# Altium schematic sheet connectors.SchDoc
size A3; Organization: Develer s.r.l.; Address1: via Mugellese 1/A; Address2: 50019 Campi Bisenzio; Address3: Firenze; Address4: ITALY; Revision: A; SheetNumber: 1; SheetTotal: 1
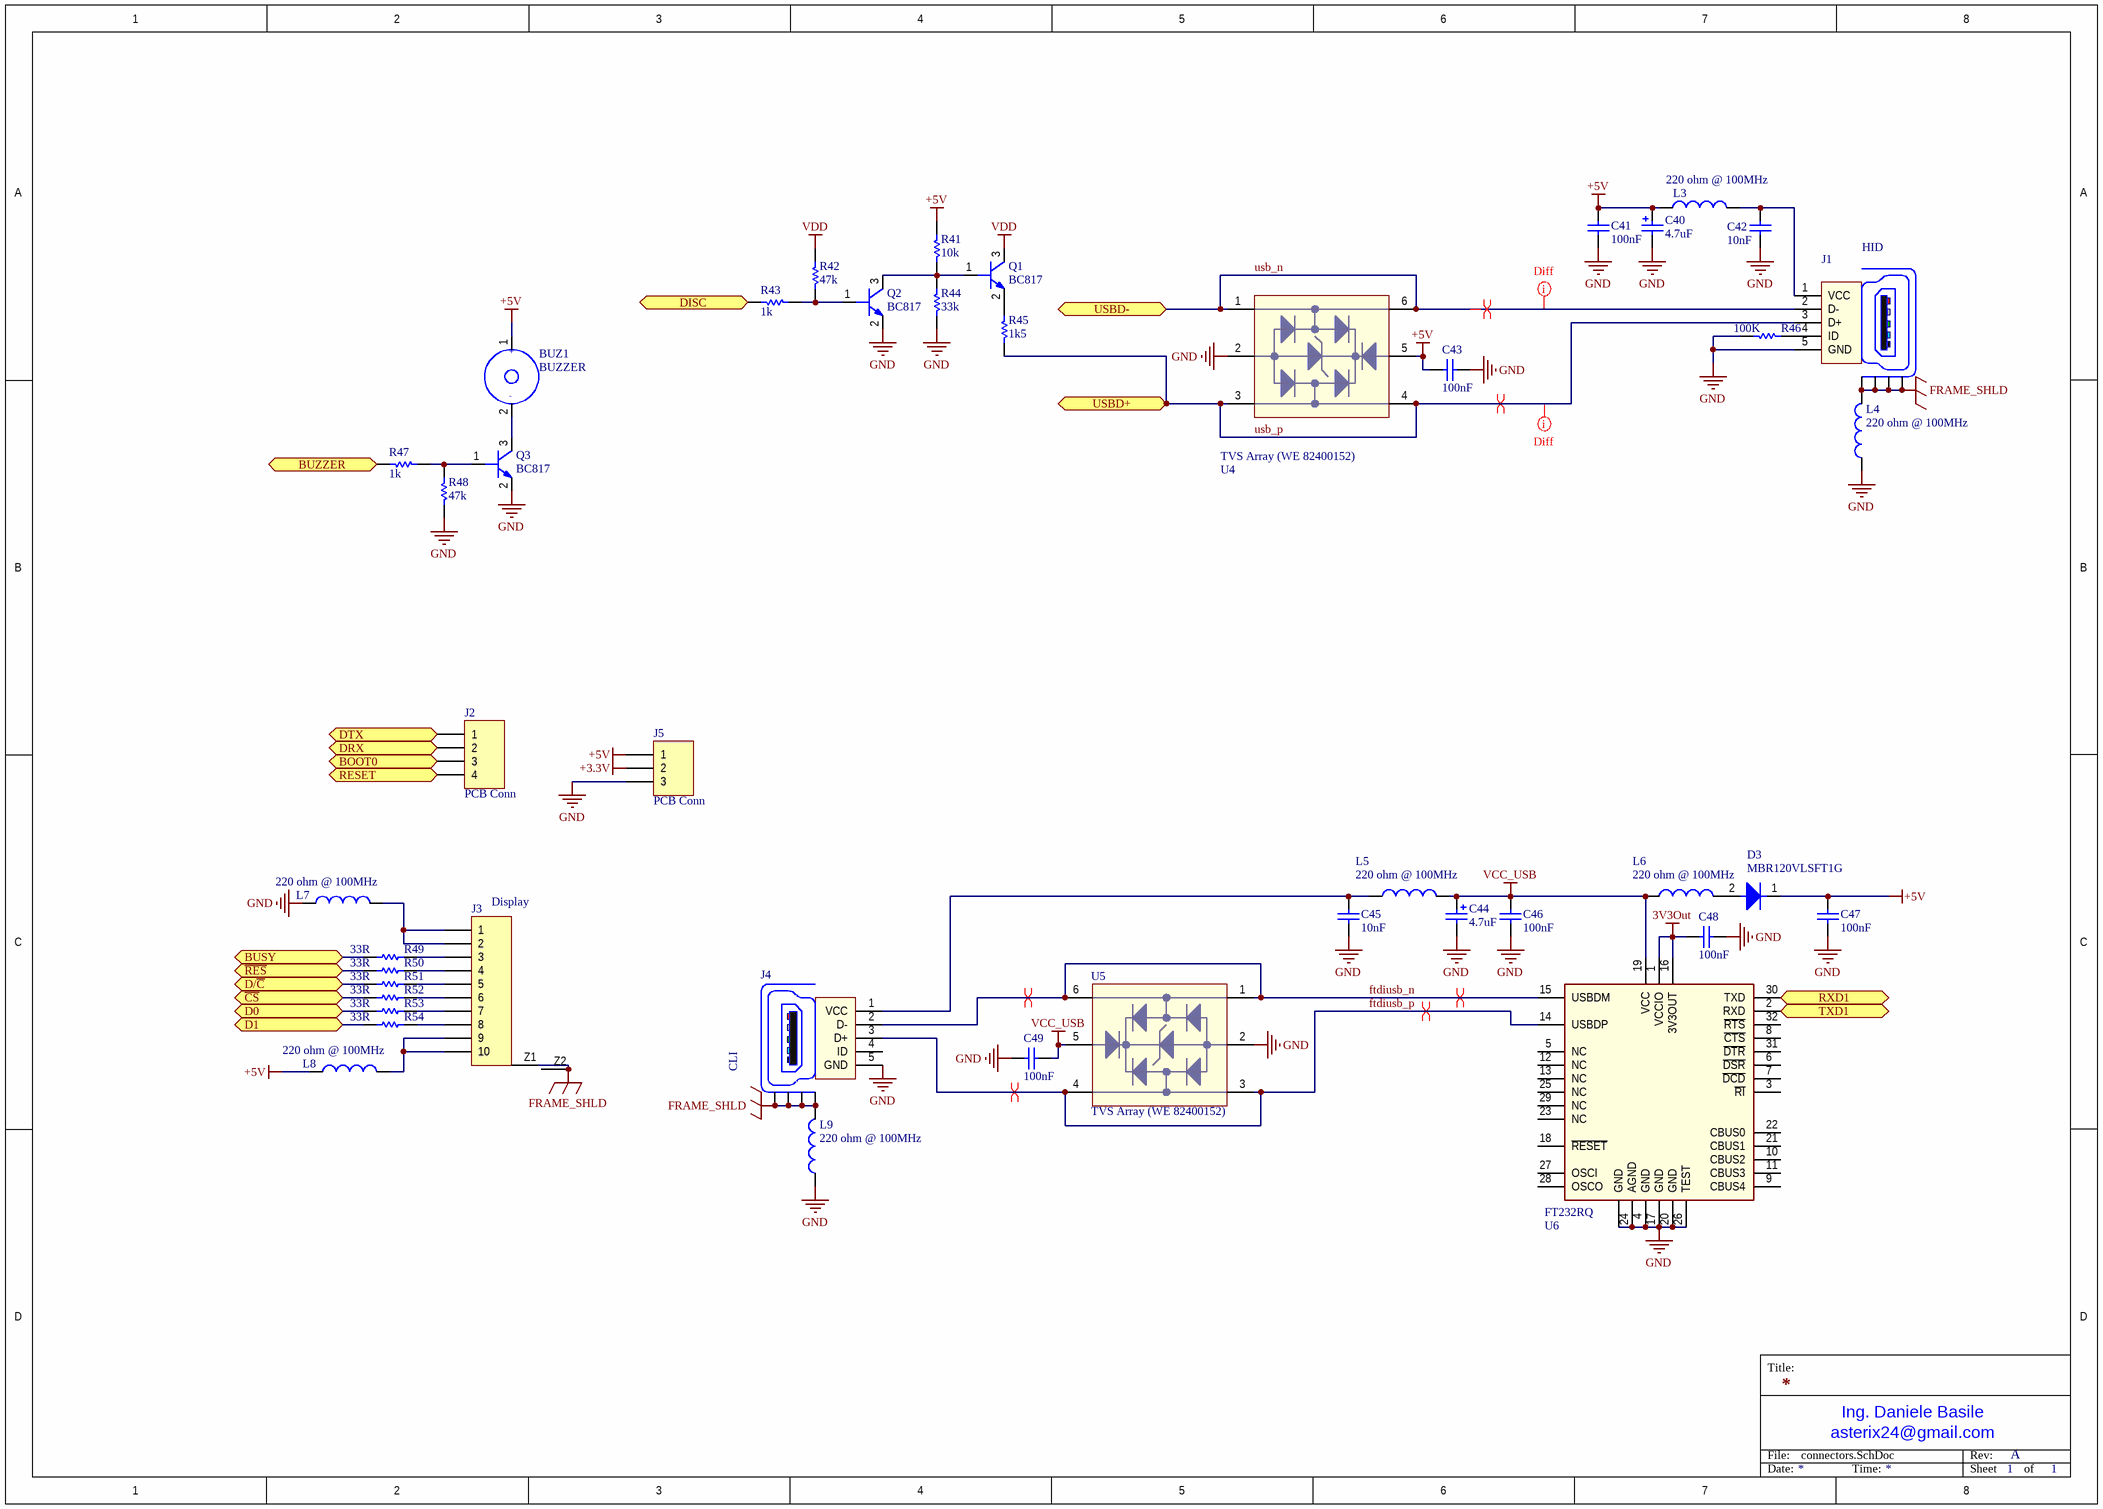
[diagram p0: connectors.SchDoc]

## Parts
BUZ1  BUZZER  [buzzer_14mm_thd]
C40  4.7uF  [1206_[3216]]
C41  100nF  [0603_[1608]]
C42  10nF  [0603_[1608]]
C43  100nF  [0603_[1608]]
C44  4.7uF  [1206_[3216]]
C45  10nF  [0603_[1608]]
C46  100nF  [0603_[1608]]
C47  100nF  [0603_[1608]]
C48  100nF  [0603_[1608]]
C49  100nF  [0603_[1608]]
D3  MBR120VLSFT1G  [SOD-123]
J1  HID  [usb_typeB_mini_smd]
J2  PCB Conn  [HEADER_1X4_2.54MM_THD]
J3  Display  [fcc-zif_10pin_0.5mm]
J4  CLI  [usb_typeB_mini_smd]
J5  PCB Conn  [HEADER_1X3_2.54MM_THD]
L3  220 ohm @ 100MHz  [0805_[2012]]
L4  220 ohm @ 100MHz  [0805_[2012]]
L5  220 ohm @ 100MHz  [0805_[2012]]
L6  220 ohm @ 100MHz  [0805_[2012]]
L7  220 ohm @ 100MHz  [0805_[2012]]
L8  220 ohm @ 100MHz  [0805_[2012]]
L9  220 ohm @ 100MHz  [0805_[2012]]
Q1  BC817  [SOT-23]
Q2  BC817  [SOT-23]
Q3  BC817  [SOT-23]
R41  10k  [0603_[1608]]
R42  47k  [0603_[1608]]
R43  1k  [0603_[1608]]
R44  33k  [0603_[1608]]
R45  1k5  [0603_[1608]]
R46  100K  [0603_[1608]]
R47  1k  [0603_[1608]]
R48  47k  [0603_[1608]]
R49  33R  [0603_[1608]]
R50  33R  [0603_[1608]]
R51  33R  [0603_[1608]]
R52  33R  [0603_[1608]]
R53  33R  [0603_[1608]]
R54  33R  [0603_[1608]]
U4  TVS Array (WE 82400152)  [SOT-563]
U5  TVS Array (WE 82400152)  [SOT-563]
U6  FT232RQ  [QFN-32]

## Ports
BOOT0, BUSY, BUZZER, D0, D1, D/~{C}, DISC, DRX, DTX, RESET, RXD1, TXD1, USBD+, USBD-, ~{CS}, ~{RES}

## Nets
3V3Out: C48.1 U6.1(VCCIO) U6.16(3V3OUT)
+3.3V: J5.2
+5V: BUZ1.1 C40.1 C41.1 C43.2 C47.2 D3.1(K) J5.1 L3.1 L8.1 R41.1 U4.5
FRAME_SHLD: J1.Z1(Shield) J1.Z2(Shield) J1.Z3(Shield) J1.Z4(Shield) J3.Z1 J3.Z2 J4.Z1(Shield) J4.Z2(Shield) J4.Z3(Shield) J4.Z4(Shield) L4.2 L9.2
GND: C40.2 C41.2 C42.2 C43.1 C44.2 C45.2 C46.2 C47.1 C48.2 C49.1 J1.5(GND) J4.5(GND) J5.3 L4.1 L7.1 L9.1 Q2.2(E) Q3.2(E) R44.2 R46.2 R48.2 U4.2 U5.2 U6.4(GND) U6.17(GND) U6.20(GND) U6.24(AGND) U6.26(TEST) U6.GND_PAD(GND)
VCC_USB: C44.1 C46.1 C49.2 L5.1 L6.2 U5.5 U6.19(VCC)
VDD: Q1.3(C) R42.1
BOOT0: J2.3 ; port BOOT0
BUSY: R49.2 ; port BUSY
BUZZER: R47.2 ; port BUZZER
~{CS}: R52.2 ; port ~{CS}
D0: R53.2 ; port D0
D1: R54.2 ; port D1
D/~{C}: R51.2 ; port D/~{C}
DISC: R43.2 ; port DISC
DRX: J2.2 ; port DRX
DTX: J2.1 ; port DTX
ftdiusb_n: J4.2(D-) U5.1 U5.6 U6.15(USBDM)
ftdiusb_p: J4.3(D+) U5.3 U5.4 U6.14(USBDP)
~{RES}: R50.2 ; port ~{RES}
RESET: J2.4 ; port RESET
RXD1: U6.30(TXD) ; port RXD1
TXD1: U6.2(RXD) ; port TXD1
usb_n: J1.2(D-) U4.1 U4.6 ; port USBD-
usb_p: J1.3(D+) R45.2 U4.3 U4.4 ; port USBD+
NetBUZ1_2: BUZ1.2 Q3.3(C)
NetC42_1: C42.1 J1.1(VCC) L3.2
NetC45_1: C45.1 J4.1(VCC) L5.2
NetD3_2: D3.2(A) L6.1
NetJ1_4: J1.4(ID) R46.1
NetJ3_1: J3.1 J3.2 L7.2
NetJ3_3: J3.3 R49.1
NetJ3_4: J3.4 R50.1
NetJ3_5: J3.5 R51.1
NetJ3_6: J3.6 R52.1
NetJ3_7: J3.7 R53.1
NetJ3_8: J3.8 R54.1
NetJ3_9: J3.9 J3.10 L8.2
NetQ1_1: Q1.1(B) Q2.3(C) R41.2 R44.1
NetQ1_2: Q1.2(E) R45.1
NetQ2_1: Q2.1(B) R42.2 R43.1
NetQ3_1: Q3.1(B) R47.1 R48.1

Not connected (* = marked no-connect by the designer): J4 4(ID); U6 3(~{RI}) 5(NC) 6(~{DSR}) 7(~{DCD}) 8(~{CTS}) 9(CBUS4) 10(CBUS2) 11(CBUS3) 12(NC) 13(NC) 18(~{RESET}) 21(CBUS1) 22(CBUS0) 23(NC) 25(NC) 27(OSCI) 28(OSCO) 29(NC) 31(~{DTR}) 32(~{RTS})

## Layout directives
net class usb_diff: usb_n, usb_p
differential pair: ftdiusb_n, ftdiusb_p, usb_n, usb_p

## Notes on the sheet
- Title:
- File:
- asterix24@gmail.com
- Ing. Daniele Basile
- Rev:
- Date:
- Time:
- Sheet
- of
- (in symbol BUZZER) +; -

## Library data of the parts
C40 = Cap Pol1: Ceramic X7R 16V; Value: 10uF; Published: 8-Jun-2000; Revision: July-2002: Re-released for DXP Platform.; Publisher: Altium Limited
C41 C46-C48 = Cap: Ceramic X7R 50V; Value: 10nF; Published: 8-Jun-2000; Revision: July-2002: Re-released for DXP Platform.; Publisher: Altium Limited
C42 C45 = Cap: Ceramic X7R 50V; Published: 8-Jun-2000; Revision: July-2002: Re-released for DXP Platform.; Publisher: Altium Limited; Value: 10nF
C43 C49 = Cap: Ceramic X7R 50V; Value: 100pF; Published: 8-Jun-2000; LatestRevisionDate: 17-Jul-2002; LatestRevisionNote: Re-released for DXP Platform.; PackageReference: RAD-0.3; Publisher: Altium Limited; PackageDescription: Radial Cap, Thru-Hole; 2 Leads; 0.3 in Pin Spacing
C44 = Cap Pol1: Ceramic X5R 25V; Value: 10uF; Published: 8-Jun-2000; Revision: July-2002: Re-released for DXP Platform.; Publisher: Altium Limited
D3 = Diode: Diode Schottky  low Vf, If 1A (PMEG3010ER; MBRX120LF)
J1 = USB_Con_Type_B_mini_SMT: Mini USB SMT Type B 5 Contacts; Manufacturer: Würth Elektronik eiSos GmbH; partNo: 65100516121; ComponentLink1 Description: Manufacturer; ComponentLink2 Description: Datasheet; NoPins: 5; ComponentLink1URL: http://www.we-online.de; ComponentLink2URL: http://katalog.we-online.de/em/datasheet/65100516121.pdf; Created by: Karrer Zheng; Created Date: 10/10/2014
J2 = Header 4: Header, 4-Pin; LatestRevisionDate: 17-Jul-2002; LatestRevisionNote: Re-released for DXP Platform.; Publisher: Altium Limited
J3 = Header 10: Header, 10-Pin; LatestRevisionDate: 17-Jul-2002; LatestRevisionNote: Re-released for DXP Platform.; Publisher: Altium Limited
J4 = USB_Con_Type_B_mini_SMT: Mini USB SMT Type B 5 Contacts (WE 65100516121); Manufacturer: Würth Elektronik eiSos GmbH; ComponentLink1 Description: Manufacturer; ComponentLink2 Description: Datasheet; NoPins: 5; ComponentLink1URL: http://www.we-online.de; ComponentLink2URL: http://katalog.we-online.de/em/datasheet/65100516121.pdf; Created by: Karrer Zheng; Created Date: 10/10/2014; partNo: 65100516121
J5 = Header 3: Header, 3-Pin; LatestRevisionDate: 17-Jul-2002; LatestRevisionNote: Re-released for DXP Platform.; Publisher: Altium Limited
L3-L9 = Inductor: WE 742792022
Q1-Q3 = BC817: BJT NPN
R41 R42 R44 R45 R48-R54 = Res1: Resistor; Value: 1K; Published: 8-Jun-2000; Revision: July-2002: Re-released for DXP Platform.; Publisher: Altium Limited
R43 R47 = Res1: Resistor; Published: 8-Jun-2000; Revision: July-2002: Re-released for DXP Platform.; Publisher: Altium Limited; Value: 1K
R46 = Resistor_ST: Resistor; Value: 10K
U4 U5 = TVS_Diode_Array
U6 = FT232RQ: Serial TTL 232 <-> USB (QFN-32)